# EAGLE design LED_Matrix_3_4 (EAGLE 8.2.2)
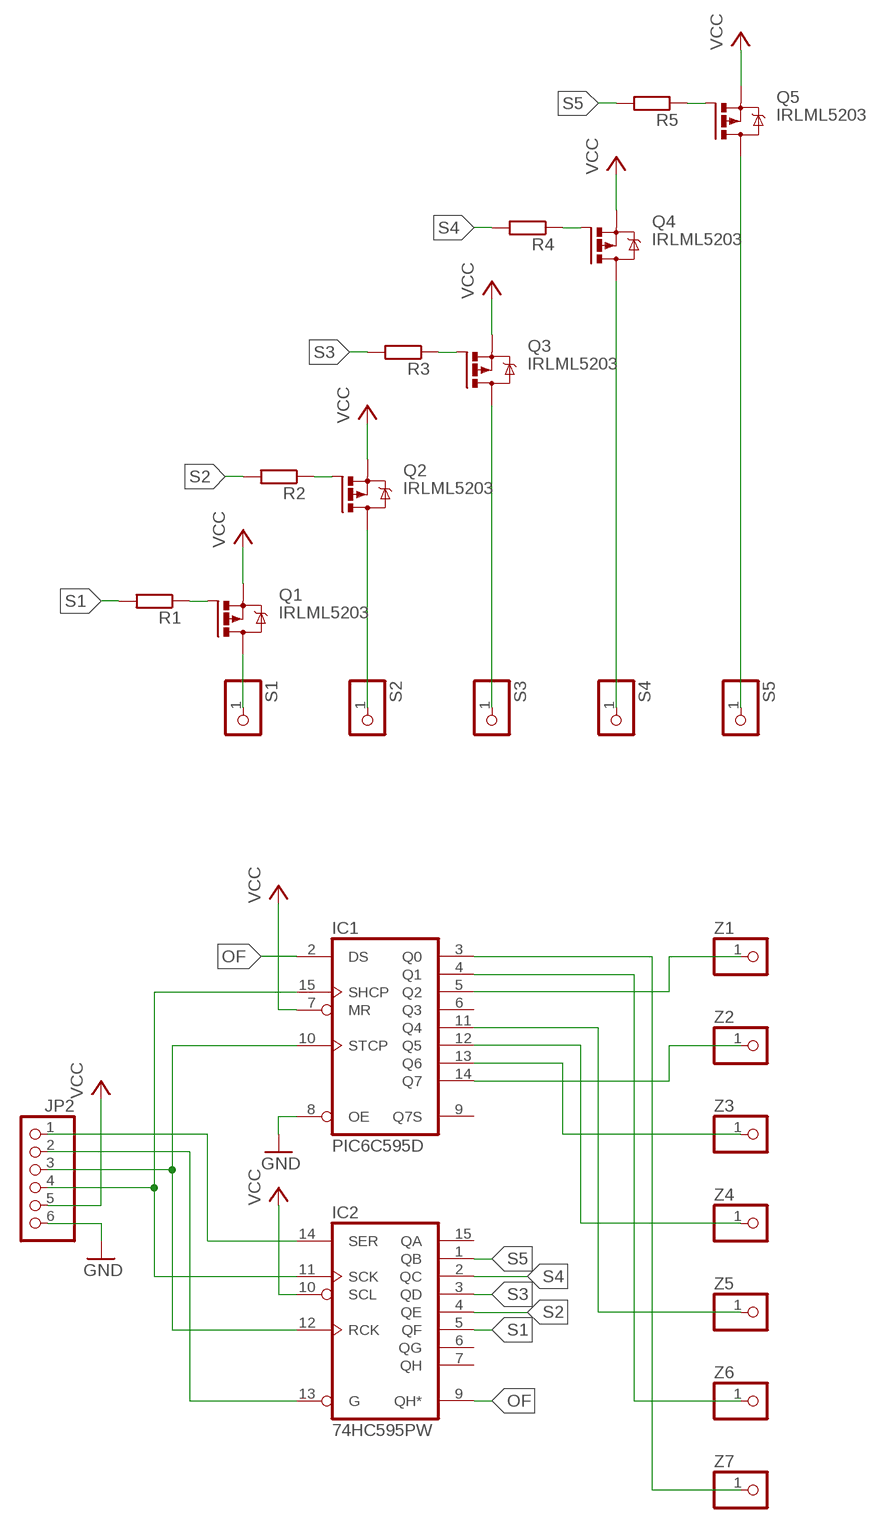
[diagram p0: schematic, sheet 1]

## Parts
IC1  PIC6C595D  [SO16]
IC2  74HC595PW  [TSSOP16]
JP2  PINHD-1X6  [1X06]
Q1  IRLML5203  [MICRO3]
Q2  IRLML5203  [MICRO3]
Q3  IRLML5203  [MICRO3]
Q4  IRLML5203  [MICRO3]
Q5  IRLML5203  [MICRO3]
R1  R-EU_R0603  [R0603]
R2  R-EU_R0603  [R0603]
R3  R-EU_R0603  [R0603]
R4  R-EU_R0603  [R0603]
R5  R-EU_R0603  [R0603]
S1  PINHD-1X1  [1X01]
S2  PINHD-1X1  [1X01]
S3  PINHD-1X1  [1X01]
S4  PINHD-1X1  [1X01]
S5  PINHD-1X1  [1X01]
Z1  PINHD-1X1  [1X01]
Z2  PINHD-1X1  [1X01]
Z3  PINHD-1X1  [1X01]
Z4  PINHD-1X1  [1X01]
Z5  PINHD-1X1  [1X01]
Z6  PINHD-1X1  [1X01]
Z7  PINHD-1X1  [1X01]

## Nets
GND: IC1.8(OE) JP2.6
N$1: IC1.10(STCP) IC2.12(RCK) JP2.3
N$2: IC1.15(SHCP) IC2.11(SCK) JP2.4
N$3: IC2.14(SER) JP2.1
N$4: IC1.3(Q0) Z7.1
N$5: IC1.4(Q1) Z6.1
N$6: IC2.13(G) JP2.2
N$8: IC1.5(Q2) Z1.1
N$9: Q2.1(G) R2.1
N$10: IC1.14(Q7) Z2.1
N$11: IC1.13(Q6) Z3.1
N$12: IC1.12(Q5) Z4.1
N$13: IC1.11(Q4) Z5.1
N$15: Q3.1(G) R3.1
N$16: Q4.1(G) R4.1
N$17: Q5.1(G) R5.1
N$18: Q1.1(G) R1.1
N$19: Q5.3(D) S5.1
N$20: Q4.3(D) S4.1
N$21: Q3.3(D) S3.1
N$22: Q2.3(D) S2.1
N$23: Q1.3(D) S1.1
OF: IC1.2(DS) IC2.9(QH*)
S1: IC2.5(QF) R1.2
S2: IC2.4(QE) R2.2
S3: IC2.3(QD) R3.2
S4: IC2.2(QC) R4.2
S5: IC2.1(QB) R5.2
VCC: IC1.7(MR) IC2.10(SCL) JP2.5 Q1.2(S) Q2.2(S) Q3.2(S) Q4.2(S) Q5.2(S)
Unconnected: IC1.6(Q3) IC1.9(Q7S) IC2.6(QG) IC2.7(QH) IC2.15(QA)

## Power pins joined to a net without a drawn wire
GND: IC1.16(GND) IC2.8(GND)
VCC: IC1.1(VCC) IC2.16(VCC)

## Library data of the parts
IC1 = PIC6C595:PIC6C595: Power Logic 8-Bit Shift Register The PIC6C595 is an 8-bit serial-in/serial or parallel-out shift register with a storage register and open-drain outputs designed for use in systems that require relatively moderate load power such as LEDs. The device contains a built-in voltage clamp on the outputs for inductive transient protection. Power driver applications include relays, solenoids, and other low-current or medium-voltage loads.
IC2 = 74xx-eu:74*595: 8-bit SHIFT REGISTER, output latch
JP2 = pinhead:PINHD-1X6: PIN HEADER
Q1-Q5 = transistor-power:IRLML5203: HEXFET P-Channel Power MOSFET
R1-R5 = resistor:R-EU_: RESISTOR, European symbol
S1-S5 Z1-Z7 = pinhead:PINHD-1X1: PIN HEADER

## Board
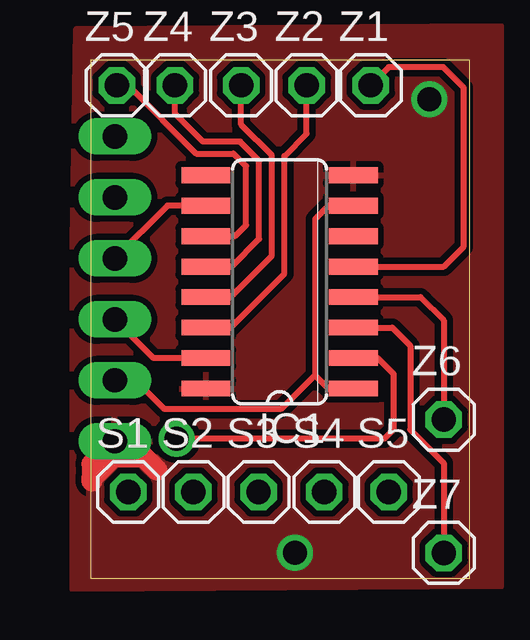
[diagram p1: board, top side]
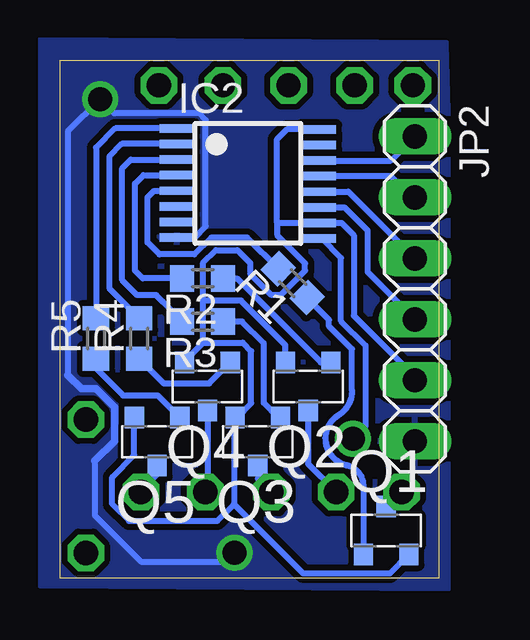
[diagram p2: board, bottom side, seen from below]

Size 15.8 x 21.6 mm. Coordinates in mm from the lower left corner, seen from the top.
Outline: 0,0 15.8,0 15.8,21.6 0,21.6 0,0
Copper layers (1*16): Top 0.035mm / dielectric 1.5mm / Bottom 0.035mm
Design rules "default *": minimum track width 10mil, minimum drill 24mil, track to track 8mil, track to pad 12mil, pad to pad 8mil, via to via 8mil, smd to smd 8mil, copper to edge 0mil, drill to drill 8mil, minimum pad ring 10mil, minimum via ring 8mil, stop-mask expansion 4mil, vias tented up to drill 0mil, thermal gap 10mil
tRestrict: area 12.4,9.2 to 12.8,9.7; area 3,7.7 to 3.4,8.7
bRestrict: area 9.7,8.6 to 10,9.2; area 8.3,7.5 to 8.9,8.1; area 12.4,7.9 to 13.1,8.5; area 13.3,9.9 to 13.4,10; area 12,13 to 12.1,13.1; area 2.5,9.1 to 2.6,9.2; area 6.2,15.4 to 6.2,18.1; area 9,4.7 to 9.2,5.8; area 11.4,8.8 to 11.5,9.8; area 2.5,4.4 to 2.8,4.8; area 4,7.3 to 6.9,8.7; area 6.1,5 to 9,6.2; 7 more areas

### Footprints (pad centres in the part's own frame; a part is rotated, then mirrored left to right if it is on the bottom)
SO16 = smd 0.66 x 2.032: 1 -4.445,-3.073; 2 -3.175,-3.073; 3 -1.905,-3.073; 4 -0.635,-3.073; 5 0.635,-3.073; 6 1.905,-3.073; 7 3.175,-3.073; 8 4.445,-3.073; 9 4.445,3.073; 10 3.175,3.073; 11 1.905,3.073; 12 0.635,3.073; 13 -0.635,3.073; 14 -1.905,3.073; 15 -3.175,3.073; 16 -4.445,3.073
TSSOP16 = smd 0.35 x 1.45: 1 -2.295,-2.95; 2 -1.645,-2.95; 3 -0.995,-2.95; 4 -0.345,-2.95; 5 0.305,-2.95; 6 0.955,-2.95; 7 1.605,-2.95; 8 2.255,-2.95; 9 2.295,2.95; 10 1.645,2.95; 11 0.995,2.95; 12 0.345,2.95; 13 -0.305,2.95; 14 -0.955,2.95; 15 -1.605,2.95; 16 -2.255,2.95
1X06 = drill 1.016 long: 1 -6.35,0; 2 -3.81,0; 3 -1.27,0; 4 1.27,0; 5 3.81,0; 6 6.35,0
MICRO3 = smd 0.8 x 0.9: 1 -0.95,-1; 2 0.95,-1; 3 0,1
R0603 = smd 1 x 1.1: 1 -0.85,0; 2 0.85,0
1X01 = drill 1.016 octagon: 1 0,0

### Placement (x,y rotation side)
IC1  7.87,12.36 90 top
IC2  7.97,16.46 270 bottom
JP2  1,12.06 270 bottom
Q1  2.2,2 0 bottom
Q2  5.45,8 180 bottom
Q3  7.55,5.7 180 bottom
Q4  9.65,8 180 bottom
Q5  11.75,5.7 180 bottom
R1  6.1,12.3 135 bottom
R2  9.85,12.5 180 bottom
R3  9.85,10.7 180 bottom
R4  12.5,10 90 bottom
R5  14.3,10 90 bottom
S1  1.56,3.6 0 top
S2  4.28,3.6 0 top
S3  7,3.6 0 top
S4  9.74,3.6 0 top
S5  12.43,3.6 0 top
Z1  11.68,20.55 0 top
Z2  9,20.55 0 top
Z3  6.27,20.55 0 top
Z4  3.51,20.55 0 top
Z5  1.08,20.55 0 top
Z6  14.72,6.62 0 top
Z7  14.72,1.06 0 top

### Tracks (layer width: path | path; a pad name or v marks a point on that pad's centre or on a via)
GND  (via drill 1)
  Top 0.87: 2.2,5.08 1.56,5.71 JP2.6 0.36,5.08 | 2.2,5.08 2.75,4.53 | 0.05,4.2 0.05,4.76 0.36,5.08 | 0.05,4.2 0.05,4.05 | 0.36,5.08 0.93,5.08 | 0.93,5.08 2.2,5.08 | 0.93,5.08 0.05,4.2
  Bottom 0.254: IC2.8 10.2,14.2 9.72,14.68 9.72,19.1 10,19.38 13.53,19.38 v14.12,19.97 15.47,18.62 15.47,8.47 | 14.18,19.38 14.2,19.4 | 14.35,4.9 14.35,2.62 12.43,0.7 8.9,0.7 v8.53,1.06
  Bottom 0.305: 15.47,8.47 14.9,7.9 14.3,7.9 13.53,7.12 13.53,5.72 14.35,4.9
  pour Bottom (isolate 0.254): -0.22,21.76 -0.08,-0.34 16.01,-0.22 16.01,21.74 11.59,21.71
  pour Top (isolate 0.254): 0.13,21.89 16.19,22.02 15.99,-0.2 -0.1,-0.33 0.1,15.84
N$1
  Top 0.254: IC1.10 3.2,15.53 JP2.3
  Bottom 0.254: IC2.12 3.78,16.11 JP2.3
N$2
  Top 0.254: IC1.15 2.61,9.18 JP2.4
  Bottom 0.254: IC2.11 3.94,15.46 2.98,14.5 2.98,12.77 JP2.4
N$3
  Bottom 0.254: JP2.1 2,17.41 IC2.14
N$4
  Top 0.254: IC1.3 12.57,10.45 13.32,9.7 13.32,6.2 14.72,4.8 Z7.1
N$5
  Top 0.254: IC1.4 13.75,11.72 14.72,10.75 Z6.1
N$6
  Bottom 0.254: IC2.13 2.01,16.76 1.12,15.88 JP2.2
N$7
  pour Top (isolate 0.254): -0.61,22.89 17.11,23.02 17.11,-0.33 -0.76,-0.46 -0.76,14
N$8
  Top 0.254: IC1.5 14.72,12.99 15.55,13.82 15.55,20.45 14.7,21.3 12.43,21.3 Z1.1
N$9
  Bottom 0.254: R2.1 8.43,12.5 4.92,9 Q2.1
N$10
  Top 0.254: IC1.14 5.83,10.45 8.07,12.7 8.07,17.6 9,18.53 Z2.1
N$11
  Top 0.254: IC1.13 5.82,11.72 7.55,13.45 7.55,17.62 6.27,18.9 Z3.1
N$12
  Top 0.254: IC1.12 5.87,12.99 7.03,14.15 7.03,17.4 6.22,18.2 4.67,18.2 3.51,19.36 Z4.1
N$13
  Top 0.254: IC1.11 6.01,14.26 6.47,14.72 6.47,17.18 5.95,17.7 4.4,17.7 1.55,20.55 Z5.1 1.33,20.55
N$14
  pour Bottom (isolate 0.254): -0.29,22.3 16.61,22.43 16.61,-0.29 -0.38,-0.42 -0.38,19.46
N$15
  Bottom 0.254: R3.1 8.2,10.7 7.3,9.8 7.3,7.3 6.7,6.7 | 6.7,6.7 Q3.1 6.7,6.7
N$16
  Bottom 0.254: 12.5,8.88 R4.1 11.47,8.12 9.57,8.12 Q4.1
N$17
  Bottom 0.254: R5.1 14.3,8.75 13.18,7.62 11.72,7.62 Q5.1
N$18
  Bottom 0.254: Q1.1 3.15,3.88 arc-76 3.85,4.72 arc134 4.22,6.78 arc-59 3.62,7.83 3.62,9.55 4.58,10.5 4.58,10.78 R1.1
N$19
  Bottom 0.254: S5.1 12.43,3.67 11.75,4.35 Q5.3
N$20
  Bottom 0.254: Q4.3 9.65,3.69 S4.1
N$21
  Bottom 0.254: Q3.3 7.55,4.15 S3.1
N$22
  Bottom 0.254: Q2.3 5.45,4.77 S2.1
N$23
  Bottom 0.254: Q1.3 1.6,3.6 S1.1
OF  (via drill 1)
  Top 0.254: IC1.2 11.97,9.18 12.62,8.53 12.62,6.2 12.25,5.83 v3.58,5.83
  Bottom 0.254: v3.58,5.83 3.05,6.35 3.05,9.7 4.08,10.72 4.08,13.35 4.87,14.15 5,14.15 IC2.9
S1
  Bottom 0.254: IC2.5 11.88,16.15 12.15,15.88 12.15,14 11.65,13.5 10.2,13.5 9.5,14.2 8,14.2 R1.2
S2
  Bottom 0.254: R2.2 12.35,12.5 12.68,12.82 12.68,16.45 12.32,16.8 IC2.4
S3
  Bottom 0.254: R3.2 11.52,11.52 11.52,11.53 11.79,11.8 12.57,11.8 13.2,12.43 13.2,17.1 12.85,17.45 IC2.3
S4
  Bottom 0.254: IC2.2 13.22,18.1 13.75,17.57 13.75,12.1 R4.2
S5
  Bottom 0.254: IC2.1 13.5,18.75 14.3,17.95 R5.2
VCC
  Top 0.254: IC1.7 9.91,15.53 9.35,14.97 9.35,8.47 | IC1.1 9.91,7.91 9.35,8.47 | JP2.5 1.87,8.26 3.08,7.05 7.92,7.05 9.35,8.47
  Bottom 0.254: 9.85,11.49 9.85,9.85 9.82,9.82 | Q2.2 6.4,9.72 8.25,11.57 9.77,11.57 9.85,11.49 | IC2.16 6.34,18.71 6.75,18.3 6.75,14.81 | 6.75,14.81 IC2.10 4.06,14.81 3.55,14.3 3.55,10.95 1,8.4 JP2.5 | 8.55,3.1 9.25,2.4 12.93,2.4 13.62,3.1 13.62,4.22 12.7,5.15 Q5.2 | 9.85,11.49 9.85,13.12 9.3,13.68 8.4,13.68 7.88,13.15 7.88,12.7 6.97,11.8 6.6,11.8 5.58,12.82 5.58,13.12 6.75,14.3 6.75,14.81 | 9.82,9.82 8.18,9.82 7.83,9.47 7.83,7.3 8.43,6.7 Q3.2 8.55,6.65 8.55,3.1 | 10.67,9 Q4.2 10.6,9.05 9.82,9.82 | Q1.2 2.05,0.2 5.65,0.2 8.55,3.1

### Text on the board
Document: Zusatzanzeiger / -> Steuerungsplatine